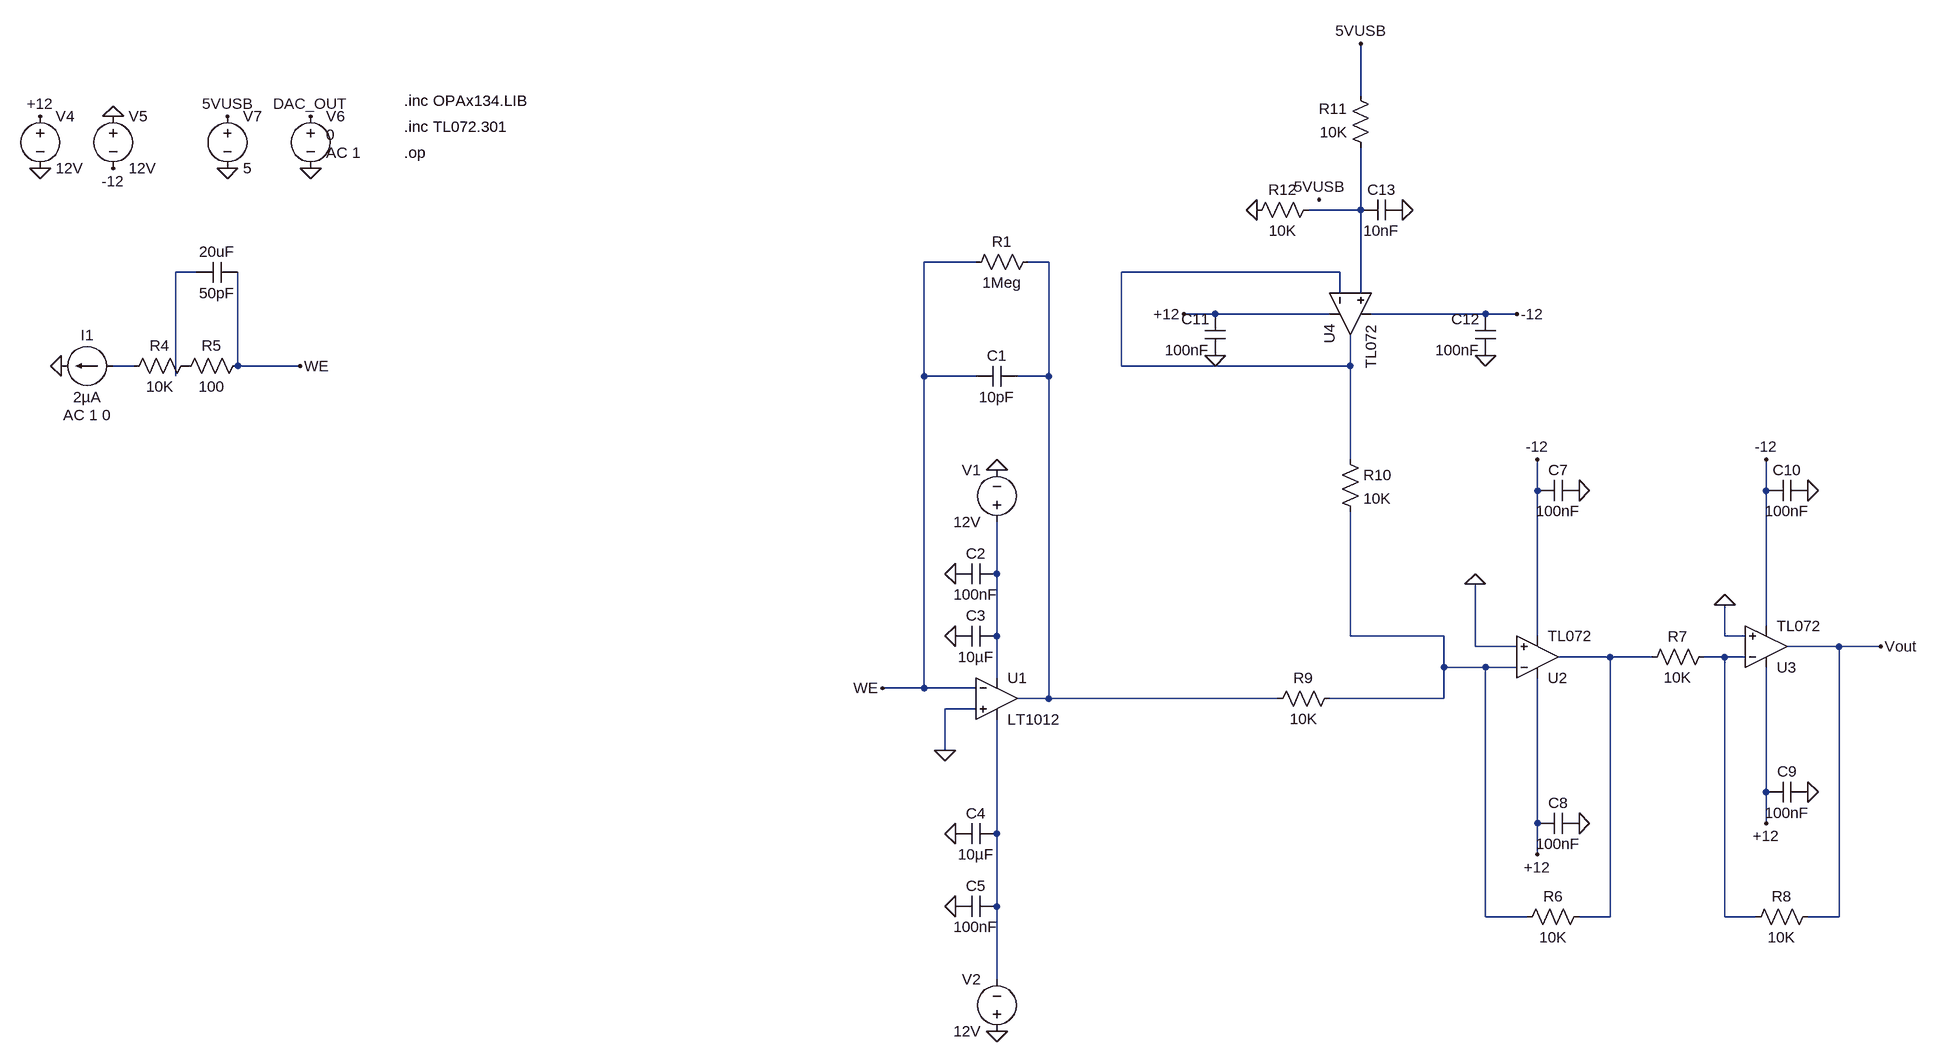
[diagram p0: schematic TIA_DC_OP_PNT_1.asc]
TIA_DC_OP_PNT_1.asc, the LTspice schematic file:
Version 4.1
SHEET 1 1592 712
WIRE 720 -768 720 -848
WIRE 720 -592 720 -688
WIRE 720 -592 640 -592
WIRE 128 -512 48 -512
WIRE 240 -512 208 -512
WIRE -1072 -496 -1104 -496
WIRE 688 -496 352 -496
WIRE 688 -464 688 -496
WIRE 720 -464 720 -592
WIRE 496 -432 448 -432
WIRE 672 -432 496 -432
WIRE 912 -432 736 -432
WIRE 960 -432 912 -432
WIRE -1168 -352 -1200 -352
WIRE -1008 -352 -1008 -496
WIRE -912 -352 -1008 -352
WIRE 352 -352 352 -496
WIRE 704 -352 704 -400
WIRE 704 -352 352 -352
WIRE -1104 -336 -1104 -496
WIRE 48 -336 48 -512
WIRE 128 -336 48 -336
WIRE 240 -336 240 -512
WIRE 240 -336 192 -336
WIRE 704 -208 704 -352
WIRE 992 -160 992 -208
WIRE 1344 -160 1344 -208
WIRE 160 -32 160 -112
WIRE 1344 48 1344 -160
WIRE 160 64 160 -32
WIRE 704 64 704 -128
WIRE 848 64 704 64
WIRE 992 64 992 -160
WIRE 1280 64 1280 16
WIRE 1312 64 1280 64
WIRE 896 80 896 -16
WIRE 960 80 896 80
WIRE 1456 80 1376 80
WIRE 1520 80 1456 80
WIRE 1104 96 1024 96
WIRE 1168 96 1104 96
WIRE 1280 96 1248 96
WIRE 1312 96 1280 96
WIRE 848 112 848 64
WIRE 912 112 848 112
WIRE 960 112 912 112
WIRE 160 128 160 64
WIRE 48 144 48 -336
WIRE 48 144 -16 144
WIRE 128 144 48 144
WIRE 240 160 240 -336
WIRE 240 160 192 160
WIRE 592 160 240 160
WIRE 848 160 848 112
WIRE 848 160 672 160
WIRE 128 176 80 176
WIRE 80 240 80 176
WIRE 1344 304 1344 112
WIRE 992 352 992 128
WIRE 1344 352 1344 304
WIRE 160 368 160 192
WIRE 992 400 992 352
WIRE 160 480 160 368
WIRE 912 496 912 112
WIRE 976 496 912 496
WIRE 1104 496 1104 96
WIRE 1104 496 1056 496
WIRE 1280 496 1280 96
WIRE 1328 496 1280 496
WIRE 1456 496 1456 80
WIRE 1456 496 1408 496
WIRE 160 592 160 480
FLAG 160 -192 0
FLAG 160 672 0
FLAG 96 -32 0
FLAG 96 64 0
FLAG 96 368 0
FLAG 96 480 0
FLAG -1280 -352 0
FLAG -16 144 WE
FLAG -912 -352 WE
FLAG 992 -208 -12
FLAG 1056 -160 0
FLAG 992 400 +12
FLAG 1056 352 0
FLAG 896 -16 0
FLAG 1280 16 0
FLAG 1520 80 Vout
FLAG 1344 352 +12
FLAG 1408 304 0
FLAG 1344 -208 -12
FLAG 1408 -160 0
FLAG 448 -432 +12
FLAG 960 -432 -12
FLAG 912 -368 0
FLAG 496 -368 0
FLAG 560 -592 0
FLAG 784 -592 0
FLAG 656 -608 5VUSB
FLAG 720 -848 5VUSB
FLAG -1312 -656 0
FLAG -1200 -736 0
FLAG -1312 -736 +12
FLAG -1200 -656 -12
FLAG -896 -656 0
FLAG -896 -736 DAC_OUT
FLAG -1024 -656 0
FLAG -1024 -736 5VUSB
FLAG 80 240 0
SYMBOL OpAmps\\LT1012 160 96 R0
SYMATTR InstName U1
SYMBOL voltage 160 -96 R180
WINDOW 0 24 96 Left 2
WINDOW 3 24 16 Left 2
WINDOW 123 0 0 Left 0
WINDOW 39 0 0 Left 0
SYMATTR InstName V1
SYMATTR Value 12V
SYMBOL voltage 160 688 R180
WINDOW 0 24 96 Left 2
WINDOW 3 24 16 Left 2
WINDOW 123 0 0 Left 0
WINDOW 39 0 0 Left 0
SYMATTR InstName V2
SYMATTR Value 12V
SYMBOL cap 192 -352 R90
WINDOW 0 0 32 VBottom 2
WINDOW 3 32 32 VTop 2
SYMATTR InstName C1
SYMATTR Value 10pF
SYMBOL res 224 -528 R90
WINDOW 0 0 56 VBottom 2
WINDOW 3 32 56 VTop 2
SYMATTR InstName R1
SYMATTR Value 1Meg
SYMBOL cap 160 -48 R90
WINDOW 0 0 32 VBottom 2
WINDOW 3 32 32 VTop 2
SYMATTR InstName C2
SYMATTR Value 100nF
SYMBOL cap 160 48 R90
WINDOW 0 0 32 VBottom 2
WINDOW 3 32 32 VTop 2
SYMATTR InstName C3
SYMATTR Value 10µF
SYMBOL cap 160 352 R90
WINDOW 0 0 32 VBottom 2
WINDOW 3 32 32 VTop 2
SYMATTR InstName C4
SYMATTR Value 10µF
SYMBOL cap 160 464 R90
WINDOW 0 0 32 VBottom 2
WINDOW 3 32 32 VTop 2
SYMATTR InstName C5
SYMATTR Value 100nF
SYMBOL current -1200 -352 R90
WINDOW 0 -32 40 VBottom 2
WINDOW 3 32 40 VTop 2
WINDOW 123 60 40 VTop 2
WINDOW 39 0 0 Left 0
SYMATTR InstName I1
SYMATTR Value 2µA
SYMATTR Value2 AC 1 0
SYMBOL res -1072 -368 R90
WINDOW 0 0 56 VBottom 2
WINDOW 3 32 56 VTop 2
SYMATTR InstName R4
SYMATTR Value 10K
SYMBOL res -992 -368 R90
WINDOW 0 0 56 VBottom 2
WINDOW 3 32 56 VTop 2
SYMATTR InstName R5
SYMATTR Value 100
SYMBOL cap -1008 -512 R90
WINDOW 0 0 32 VBottom 2
WINDOW 3 32 32 VTop 2
SYMATTR InstName 20uF
SYMATTR Value 50pF
SYMBOL OpAmps\\opamp2 992 160 M180
SYMATTR InstName U2
SYMATTR Value TL072
SYMBOL cap 1056 -176 R90
WINDOW 0 0 32 VBottom 2
WINDOW 3 32 32 VTop 2
SYMATTR InstName C7
SYMATTR Value 100nF
SYMBOL cap 1056 336 R90
WINDOW 0 0 32 VBottom 2
WINDOW 3 32 32 VTop 2
SYMATTR InstName C8
SYMATTR Value 100nF
SYMBOL res 1072 480 R90
WINDOW 0 0 56 VBottom 2
WINDOW 3 32 56 VTop 2
SYMATTR InstName R6
SYMATTR Value 10K
SYMBOL res 1152 112 R270
WINDOW 0 32 56 VTop 2
WINDOW 3 0 56 VBottom 2
SYMATTR InstName R7
SYMATTR Value 10K
SYMBOL OpAmps\\opamp2 1344 144 M180
SYMATTR InstName U3
SYMATTR Value TL072
SYMBOL res 1312 512 R270
WINDOW 0 32 56 VTop 2
WINDOW 3 0 56 VBottom 2
SYMATTR InstName R8
SYMATTR Value 10K
SYMBOL cap 1408 288 R90
WINDOW 0 0 32 VBottom 2
WINDOW 3 32 32 VTop 2
SYMATTR InstName C9
SYMATTR Value 100nF
SYMBOL cap 1408 -176 R90
WINDOW 0 0 32 VBottom 2
WINDOW 3 32 32 VTop 2
SYMATTR InstName C10
SYMATTR Value 100nF
SYMBOL res 688 144 R90
WINDOW 0 0 56 VBottom 2
WINDOW 3 32 56 VTop 2
SYMATTR InstName R9
SYMATTR Value 10K
SYMBOL OpAmps\\opamp2 640 -432 M90
SYMATTR InstName U4
SYMATTR Value TL072
SYMBOL cap 512 -368 R180
WINDOW 0 24 56 Left 2
WINDOW 3 24 8 Left 2
SYMATTR InstName C11
SYMATTR Value 100nF
SYMBOL cap 928 -368 R180
WINDOW 0 24 56 Left 2
WINDOW 3 24 8 Left 2
SYMATTR InstName C12
SYMATTR Value 100nF
SYMBOL res 688 -224 R0
SYMATTR InstName R10
SYMATTR Value 10K
SYMBOL res 736 -672 R180
WINDOW 0 36 76 Left 2
WINDOW 3 36 40 Left 2
SYMATTR InstName R11
SYMATTR Value 10K
SYMBOL res 544 -576 R270
WINDOW 0 32 56 VTop 2
WINDOW 3 0 56 VBottom 2
SYMATTR InstName R12
SYMATTR Value 10K
SYMBOL cap 784 -608 R90
WINDOW 0 0 32 VBottom 2
WINDOW 3 32 32 VTop 2
SYMATTR InstName C13
SYMATTR Value 10nF
SYMBOL voltage -1312 -752 R0
WINDOW 123 0 0 Left 0
WINDOW 39 0 0 Left 0
SYMATTR InstName V4
SYMATTR Value 12V
SYMBOL voltage -1200 -752 R0
SYMATTR InstName V5
SYMATTR Value 12V
SYMBOL voltage -896 -752 R0
WINDOW 3 24 44 Left 2
WINDOW 123 24 72 Left 2
WINDOW 39 0 0 Left 0
SYMATTR Value 0
SYMATTR Value2 AC 1
SYMATTR InstName V6
SYMBOL voltage -1024 -752 R0
WINDOW 123 0 0 Left 0
WINDOW 39 0 0 Left 0
SYMATTR InstName V7
SYMATTR Value 5
TEXT -752 -760 Left 2 !.inc OPAx134.LIB
TEXT -752 -720 Left 2 !.inc TL072.301
TEXT -752 -680 Left 2 !.op

The netlist it stands for:
* TIA_DC_OP_PNT_1.asc
X§U1 0 WE N006 N010 N002 LT1012  ; pins In+ In- V+ V- OUT
V1 N006 0 12V
V2 0 N010 12V
C1 N002 WE 10pF
R1 N002 WE 1Meg
C2 N006 0 100nF
C3 N006 0 10µF
C4 N010 0 10µF
C5 N010 0 100nF
I1 N005 0 2µA AC 1 0
R4 P001 N005 10K
R5 WE P001 100
C§20uF WE N003 50pF
X§U2 0 N007 +12 -12 N008 TL072  ; pins In+ In- V+ V- OUT
C7 0 -12 100nF
C8 0 +12 100nF
R6 N008 N007 10K
R7 N008 N009 10K
X§U3 0 N009 +12 -12 Vout TL072  ; pins In+ In- V+ V- OUT
R8 N009 Vout 10K
C9 0 +12 100nF
C10 0 -12 100nF
R9 N007 N002 10K
X§U4 N001 N004 +12 -12 N004 TL072  ; pins In+ In- V+ V- OUT
C11 0 +12 100nF
C12 0 -12 100nF
R10 N004 N007 10K
R11 N001 5VUSB 10K
R12 0 N001 10K
C13 0 N001 10nF
V4 +12 0 12V
V5 0 -12 12V
V6 DAC_OUT 0 0 AC 1
V7 5VUSB 0 5
.inc OPAx134.LIB
.inc TL072.301
.op
.backanno
.end